# Altium schematic sheet PowerOutput&Switch.SchDoc
size A; DocumentNumber: 7; SheetNumber: 7; SheetTotal: 7
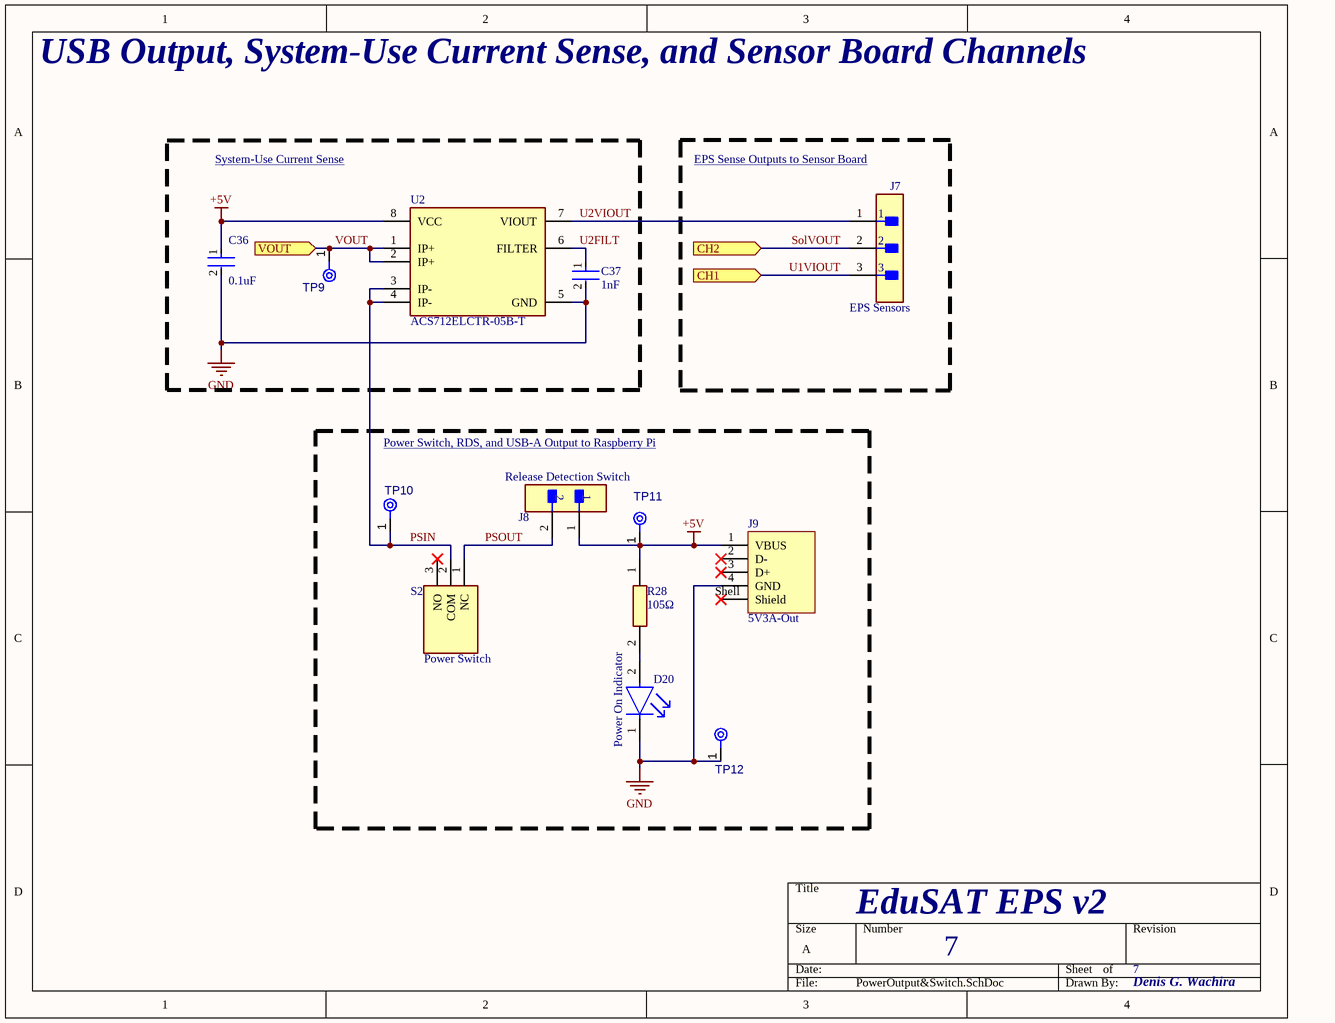
[diagram p0: PowerOutput&Switch.SchDoc]

## Parts
C36  0.1uF  [FP-CL21-IPC_A]
C37  1nF  [FP-CL21-IPC_B]
D20  Power On Indicator  [FP-LTST-C170GKT-MFG]
J7  EPS Sensors  [FP-S3B-XH-A-1_LF_SN-MFG]
J8  Release Detection Switch  [FP-S2B-XH-A-1_LF_SN-MFG]
J9  5V3A-Out  [614004135023]
R28  105Ω  [RESC2012X65N]
S2  Power Switch  [SS12D10L3]
TP9  TPAD6R  [TP06R]  (value not drawn)  (no BOM)
TP10  TPAD6R  [TP06R]  (value not drawn)  (no BOM)
TP11  TPAD6R  [TP06R]  (value not drawn)  (no BOM)
TP12  TPAD6R  [TP06R]  (value not drawn)  (no BOM)
U2  ACS712ELCTR-05B-T  [FP-LC-8-IPC_A]

## Blocks framed on the sheet
System-Use Current Sense: C36 C37 TP9 U2
EPS Sense Outputs to Sensor Board: J7
Power Switch, RDS, and USB-A Output to Raspberry Pi: D20 J8 J9 R28 S2 TP10-TP12

## Ports
CH1 (in, see EduSAT-EPSv2[3B], PowerInput&Switch[4A]), CH2 (in, see EduSAT-EPSv2[3B], PowerInput&Switch[2B]), VOUT (in, see EduSAT-EPSv2[3B], Charging&1AOut1[2C], Charging&1AOut2[2C], Charging&1AOut3[2C])

## Nets
+5V: C36.1 J8.1 J9.1(VBUS) R28.1 TP11.1(TP) U2.8(VCC)
GND: C36.2 C37.2 D20.1(C) J9.4(GND) TP12.1(TP) U2.5(GND)
PSIN: S2.2(COM) TP10.1(TP) U2.3(IP-) U2.4(IP-)
PSOUT: J8.2 S2.1(NC)
SolVOUT: J7.2 ; port CH2
U1VIOUT: J7.3 ; port CH1
U2FILT: C37.1 U2.6(FILTER)
U2VIOUT: J7.1 U2.7(VIOUT)
VOUT: TP9.1(TP) U2.1(IP+) U2.2(IP+) ; port VOUT
NetD20_2: D20.2(A) R28.2

Not connected (* = marked no-connect by the designer): J9 2(D-)* 3(D+)* Shell(Shield)*; S2 3(NO)*

## Notes on the sheet
- USB Output, System-Use Current Sense, and Sensor Board Channels
- EduSAT EPS v2
- Denis G. Wachira

## Library data of the parts
C36 = CMP-13271-002975-1: 50V 0.1uF X7R ±10% 0805 Multilayer Ceramic Capacitors MLCC - SMD/SMT ROHS TCC0805X7R104K500DT; Case Code (Imperial): 0805; Length: 2mm; Case/Package: 0805; Packaging: Tape and Reel; Width: 0.049inch; Tolerance: 10%; Mount: Surface Mount; Min Operating Temperature: -55°C; Thickness: 0.057inch; Height: 1.25mm; Dielectric: X7R; Package Quantity: 1; Depth: 1.25mm; Capacitance: 0.1uF; Voltage Rating: 50V; Case Code (Metric): 2012; Max Operating Temperature: 85°C; Radiation Hardening: No
C37 = CMP-13271-001800-1: CL21 Series 0805 1nF 50V ±10% Tolerance X7R Multilayer Ceramic Chip Capacitor / CGA0805X7R102K500KT; Contact Plating: Tin; Tolerance: 10%; Package Quantity: 4000; Voltage: 50V; Mount: Surface Mount; Material: Ceramic; Width: 0.049inch; Capacitance: 1nF; Case Code (Metric): 2012; Case Code (Imperial): 0805; Height: 0.65mm; Max Operating Temperature: 125°C; Thickness: 0.03inch; Length: 2mm; Radiation Hardening: No; Depth: 1.25mm; Packaging: Tape and Reel; Voltage Rating: 50V; Dielectric: X7R; Min Operating Temperature: -55°C; Case/Package: 0805
D20 = CMP-1674-00002-6: LED GREEN CLEAR SMD KT-0805G; Dominant Wavelength: 569nm; Lens Style: Diffused; Forward Voltage: 2.1V; Number of Elements: 1; Wavelength: 565nm; Luminous Intensity: 6mcd; Test Current: 10mA; Power Dissipation: 100mW; Reverse Voltage: 5V; Forward Current: 30mA; Viewing Angle: 130°; Lens Color: Colorless; Min Operating Temperature: -55°C; Number of Pins: 2; Max Operating Temperature: 85°C; Color: Green; Radiation Hardening: No; Illumination Color: Green; Case Code (Metric): 2012; Lens Transparency: Clear; Case/Package: 0805; Width: 1.25mm; Case Code (Imperial): 0805; Package Quantity: 1; Height: 1.1mm; Depth: 1.25mm; Length: 2mm; Power Rating: 100mW; Lead Free: Lead Free; Number of LEDs: 1; Packaging: Tape and Reel; Mount: Surface Mount; Voltage: 5V
J7 = CMP-17439-000427-1: CONN HEADER R/A 3POS 2.5MM / HCZZ0139-3; Voltage Rating: 250V; Pitch: 0.098inch; Number of Positions: 3; Contact Finish - Mating: TIN; Mount: Through Hole; Lead Free: Lead Free; Termination: Press-Fit; Fastening Type: Detent; Insulation Material: Nylon; Min Operating Temperature: -25°C; Flammability Rating: UL94 V-0; Number of Rows: 1; Contact Plating: Tin; Max Operating Temperature: 85°C; Color: Natural; Package Quantity: 1000; Insulation Color: Natural; Contact Material: Brass; Series: XH; Connector Type: Header; Contact Shape: Square; Packaging: Bulk; Contact Type: Male Pin
J8 = CMP-17439-000260-1: CONN HEADER R/A 2POS 2.5MM HCZZ0139-2; Voltage Rating: 250V; Number of Positions: 2; Contact Material: Brass; Series: XH; Contact Finish - Mating: TIN; Max Operating Temperature: 85°C; Number of Rows: 1; Packaging: Bulk; Insulation Color: Natural; Lead Free: Lead Free; Fastening Type: Detent; Termination: Press-Fit; Connector Type: Header; Insulation Material: Nylon; Contact Shape: Square; Contact Type: Male Pin; Mount: Through Hole; Min Operating Temperature: -25°C; Flammability Rating: UL94 V-0
J9 = CMP-1502-03236-2: USB 2.0 3A 1 Straight 4P Female -55℃~+85℃ Type-A Plugin USB Connectors ROHS / 916-252A1113Y10210; NexarPartId: 18818178; Number of Positions: 4; Insulation Resistance: 1GΩ; Gender: Receptacle; Number of Ports: 1; Contact Resistance: 20mΩ; Operating Supply Voltage: 30V; Current Rating: 1.5A; USB Standard: USB 2.0; Number of Pins: 4; Orientation: Vertical; Features: Shielded; Min Operating Temperature: -40°C; Number of Contacts: 4; REACH SVHC: Unknown; Contact Plating: Gold; Color: White; Termination: Solder; Connector Type: USB; Contact Material: Gold; Height: 15.2mm; Insulation Material: PBT; Mount: Through Hole, Vertical; Max Operating Temperature: 105°C; Length: 15.7mm; Voltage Rating: 30V; RoHS: Compliant; Width: 18.8mm; Lead Free: Lead Free
R28 = AECR0805F27R0K9: 125mW Thick Film Resistors 150V ±100ppm/℃ ±1% 105Ω 0805 Chip Resistor - Surface Mount ROHS CR0805F105RP05Z; Manufacturer_Name: ResistorToday; Datasheet Link: https://datasheet.lcsc.com/lcsc/2304140030_RESI-AECR0805F27R0K9_C352233.pdf; Height: 0.65mm; Manufacturer_Part_Number: AECR0805F27R0K9
S2 = SS-12D10L3: Switch; Manufacturer_Name: XKB Connectivity; Datasheet Link: http://www.helloxkb.com/public/images/pdf/SS-12D10XXX.pdf; Height: 9.6mm; Manufacturer_Part_Number: SS-12D10L3
TP9-TP12 = CMP-00028-00002-2: 0.6mm round; Pins: 1
U2 = CMP-2000-04989-2: SENSOR CURRENT HALL 5A AC/DC; Output Current: 10mA; Response Time: 5us; Number of Channels: 1; Sensitivity: 185mV/A; Polarity: Bidirectional; Linearity: 1.5%; Max Supply Current: 13mA; Frequency: 80kHz; Max Supply Voltage: 5.5V; Min Supply Voltage: 4.5V; Voltage: 5V; Mount: Surface Mount; Max Operating Temperature: 85°C; Min Operating Temperature: -40°C; Termination: SMD/SMT; Number of Pins: 8; Accuracy: 1.5%; Current Sensing: 5A; Length: 4.9mm; Package Quantity: 1; REACH SVHC: No SVHC; Packaging: Cut Tape; Series: -; Height: 1.5mm; Width: 3.9mm; Operating Supply Voltage: 5V; Bandwidth: 80kHz; Case/Package: SOIC; Lead Free: Lead Free; Quiescent Current: 10mA; RoHS Compliant: Yes